# Altium schematic sheet M.2 m-key.SchDoc
size A4; SheetNumber: 1; SheetTotal: 1
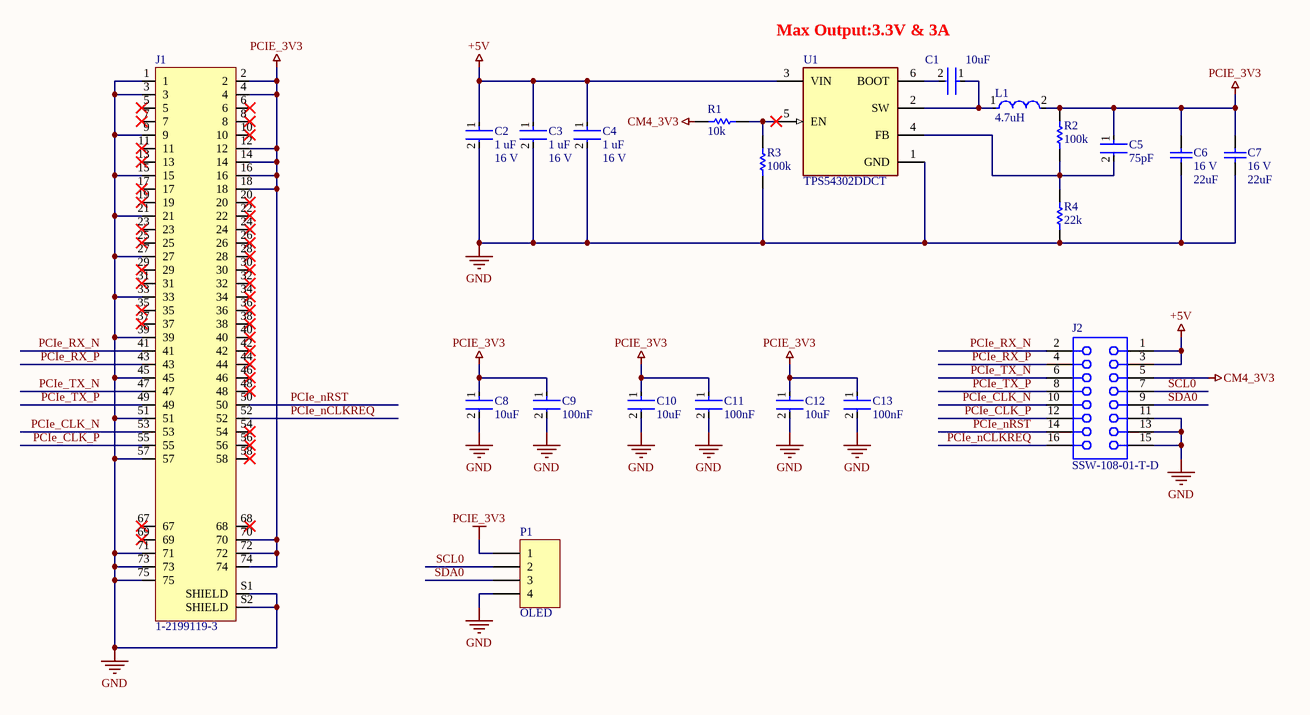
[diagram p0: M.2 m-key.SchDoc]

## Parts
C1  10uF  [FP-CC0603-DA-MFG]
C2  Capacitance: 1 uF  Voltage: 16 V  [FP-CC0603-DA-MFG]  (hidden comment: 1uF)
C3  Capacitance: 1 uF  Voltage: 16 V  [FP-CC0603-DA-MFG]  (hidden comment: 1uF)
C4  value 1 uF  Voltage: 16 V  [FP-CC0603-DA-MFG]  (hidden comment: 100nF)
C5  75pF  [FP-CC0603-DA-MFG]
C6  value 22uF  Rated Voltage: 16 V  [CAPC1206(3216)190_N]  (hidden comment: CAP 22uF 16V 1206(3216))
C7  value 22uF  Rated Voltage: 16 V  [CAPC1206(3216)190_N]  (hidden comment: CAP 22uF 16V 1206(3216))
C8  10uF  [FP-CC0603-DA-MFG]
C9  100nF  [FP-CC0603-DA-MFG]
C10  10uF  [FP-CC0603-DA-MFG]
C11  100nF  [FP-CC0603-DA-MFG]
C12  10uF  [FP-CC0603-DA-MFG]
C13  100nF  [FP-CC0603-DA-MFG]
J1  1-2199119-3  [1-2199119-3]
J2  SSW-108-01-T-D  [SMTC-SSW-108-01-X-D]
L1  Inductance: 4.7uH  [FP-XAL4030-472MEC-MFG]  (hidden comment: XAL4030-472MEC)
P1  OLED  [HDR1X4]
R1  Resistance: 10k  [RESC1608X55X25ML10T15]  (hidden comment: RC0603JR-0710KL)
R2  Resistance: 100k  [RESC1608X55X25ML10T15]  (hidden comment: RC0603FR-13100KL)
R3  Resistance: 100k  [RESC1608X55X25LL10T15]  (hidden comment: RC0603JR-10100KL)
R4  Resistance: 22k  [RESC1608X55X25ML10T15]  (hidden comment: RC0603FR-1022KL)
U1  TPS54302DDCT  [FP-DDC0006A-MFG]

## Nets
+5V: C2.1 C3.1 C4.1 J2.1 J2.3 U1.3(VIN)
CM4_3V3: J2.5 R1.2
GND: C2.2 C3.2 C4.2 C6.2 C7.2 C8.2 C9.2 C10.2 C11.2 C12.2 C13.2 J1.1 J1.3 J1.9 J1.15 J1.21 J1.27 J1.33 J1.39 J1.45 J1.51 J1.57 J1.71 J1.73 J1.75 J1.S1(SHIELD) J1.S2(SHIELD) J2.11 J2.13 J2.15 P1.4 R3.1 R4.2 U1.1(GND)
PCIE_3V3: C5.1 C6.1 C7.1 C8.1 C9.1 C10.1 C11.1 C12.1 C13.1 J1.2 J1.4 J1.12 J1.14 J1.16 J1.18 J1.70 J1.72 J1.74 L1.2 P1.1 R2.1
PCIe_CLK_N: J1.53 J2.10
PCIe_CLK_P: J1.55 J2.12
PCIe_nCLKREQ: J1.52 J2.16
PCIe_nRST: J1.50 J2.14
PCIe_RX_N: J1.41 J2.2
PCIe_RX_P: J1.43 J2.4
PCIe_TX_N: J1.47 J2.6
PCIe_TX_P: J1.49 J2.8
SCL0: J2.7 P1.2
SDA0: J2.9 P1.3
NetC1_1: C1.1 L1.1 U1.2(SW)
NetC1_2: C1.2 U1.6(BOOT)
NetC5_2: C5.2 R2.2 R4.1 U1.4(FB)
NetR1_1: R1.1 R3.2 U1.5(EN)

Not connected (* = marked no-connect by the designer): J1 5* 6* 7* 8* 10* 11* 13* 17* 19* 20* 22* 23* 24* 25* 26* 28* 29* 30* 31* 32* 34* 35* 36* 37* 38* 40* 42* 44* 46* 48* 54* 56* 58* 67* 68* 69*

## Notes on the sheet
- Max Output:3.3V & 3A
- Title:
- Author:
- Approved:
- Size:
- Date:
- Git Hash:
- A4
- Prj:
- SW Version:
- Variant:
- Edited:
- CONFIDENTIAL
- File:

## Library data of the parts
C1-C5 C8-C13 = CMP-03422-000924-1: CAP CER 1UF 16V X7R 0603; Manufacturer: YAGEO; Manufacturer Part Number: CC0603KRX7R7BB105; Tolerance: 0.1; Temperature Coefficient: 15%; Material: Ceramic; Package: CC0603-DA; RoHS: TRUE; Device Class L2: Capacitors; Temperature Characteristic: X7R; Temperature: -55°C to +125°C; Temperature Range Low: -55°C; Automotive: No; ComponentLink2Description: Datasheet; Lead Free: Yes; ComponentLink2URL: http://www.yageo.com/documents/recent/UPY-GPHC_X7R_6.3V-to-50V_18.pdf; Device Class L1: Passive Components; Octopart: https://octopart.com/cc0603krx7r7bb105-yageo-42271928; Category: Cap; Digikey Description: CAP CER 1UF 16V X7R 0603; Footprint Url: http://www.yageo.com/exep/pages/download/literatures/UPY-C_GEN_24.pdf; Height: 0.9mm; Voltage Rating: 16 V; Temperature Range High: +125°C; Mouser Description: Multilayer Ceramic Capacitor, CC Series, 1 - F, - 10%, X7R, 16 V, 0603 [1608 Metric]; Device Class L3: Ceramic Capacitors
  C1 C5 C8-C13: Value: 1 uF; Capacitance: 1 uF; Voltage: 16 V
  C2 C3: Value: 1 uF
  C4: Capacitance: 1 uF
C6 C7 = CMP-1037-04992-1: CAP 22uF 16V ±10% 1206 (3216 Metric) Thickness 1.9mm SMD; Case-EIA: 1206; Case-Metric: 3216; Tolerance: Â±10%; Technology: SMT; Max Thickness: 1.9 mm
J1 = 1-2199119-3: m.2 0.5pitch 3.2h Key m Goldflash; MF: {'manufacturer': u'TE Connectivity'}; Value: *; Price: None; MP: 1-2199119-3; Availability: Unavailable; Package: None
J2 = CMP-1023-00375-1: SQ Post Socket, Through-hole, Vertical, -55 to 105 degC, 2.54mm Pitch, 16-Pin, Female, RoHS; Manufacturer: Samtec; ComponentLink3Description: Package Specification; Orientation: Vertical; RoHS: True; PackageReference: SSW-108-01-X-D; PartNumber: SSW-108-01-T-D; PackageDescription: Assembly, Socket Strip .016 X .031 Tail; ComponentLink2Description: Datasheet; ComponentLink1URL: http://www.samtec.com; PackageVersion: CA, 6/1987; ComponentLink1Description: Manufacturer URL; Mounting Technology: Through-hole; DatasheetVersion: F-214; ComponentLink3URL: http://www.samtec.com/documents/webfiles/cpdf/SSW-1XX-XX-XXX-X-XX-XXX-XX-MKT.pdf; ComponentLink2URL: http://www.samtec.com/documents/webfiles/pdf/SSW_TH.PDF; Pitch: 2.54 mm; Temperature Range: -55 to 105 degC
L1 = CMP-11268-000082-1: Power Inductor (SMD), 4.7 µH, 5.1 A, Shielded, 4.5 A, XAL40xx Series, 4mm x 4mm x 3.1mm; Tolerance: 20%; DC Resistance (DCR): 44.1mR; Saturation Current: 4.5A; Max DC Current: 5.1A; Self Resonant Frequency: 36MHz; Test Frequency: 100kHz; Core Material: Composite; REACH SVHC: No SVHC; Height: 3.1mm; Package Quantity: 500; Width: 4.3mm; Mount: Surface Mount; RoHS Compliant: Yes; Case/Package: SMD/SMT; Length: 4.3mm; Packaging: Tape and Reel; Max Operating Temperature: 125°C; Min Operating Temperature: -40°C; Series: XAL4030; Termination: SMD/SMT; Inductance Tolerance: 20%; Shielding: Shielded; RMS Current (Irms): 5.1A; Lead Free: Contains Lead
P1 = Header 4: Header, 4-Pin; LatestRevisionDate: 17-Jul-2002; LatestRevisionNote: Re-released for DXP Platform.; Publisher: Altium Limited
R1 = CMP-2000-05022-1: Resistor, 10 KOhm, +/- 5%, 100 mW, -55 to 155 degC, 0603 (1608 Metric), RoHS, Tape and Reel; Manufacturer: Yageo; Voltage Rating: 50V; Temperature Coefficient: 100PPM/C; Power Rating: 100mW; Package Reference: 603; Series: RC; Case Code - mm: 1608; Packaging: Reel; Datasheet URL: http://www.farnell.com/datasheets/443971.pdf; Datasheet Version: Rev. 4, 04/2009; Operating Temperature Range: -55Cto+155C; Product: ThickFilmResistorsGeneralPurpose; Package Description: 2-Pin Surface Mount Device, Body 1.6 x 0.8 mm; Manufacturer URL: http://www.yageo.com/; Case Code - in: 0603; Tolerance: 5%; Termination Style: SMD/SMT
R2 = CMP-2000-04193-1: Manufacturer: Yageo; Part Number: RC0603FR-13100KL
R3 = CMP-2000-04301-1: Manufacturer: Yageo; Part Number: RC0603JR-10100KL
R4 = CMP-2000-04179-1: Manufacturer: Yageo; Part Number: RC0603FR-1022KL
U1 = CMP-04918-000098-1: IC REG BUCK ADJ 3A TSOT23-6; Manufacturer: Texas Instruments; Max Duty Cycle: 100%; Standoff Height: 0mm; Max Junction Temp: +125°C; Min Supply Voltage: 4.5V; Nominal Supply Current: 45uA; Output Voltage: 0.6-26V; Max Supply Voltage: 28V; Output Type: AdjustableProgrammable; Number Of Outputs: 1; Switching Frequency: 400kHz; Temperature Range High: +125°C; Switching Topology: Buck; Device Class L3: Voltage Regulators - Switching; Device Class L2: Power Management ICs; Lead Free: Yes; Height: 1.1mm; Package: DDC0006A; ComponentLink2Description: Datasheet; Device Class L1: Integrated Circuits (ICs); Manufacturer Part Number: TPS54302DDCT; Output Current: 3A; ComponentLink2URL: http://www.ti.com/lit/ds/symlink/tps54302.pdf; Automotive: No; Digikey Description: IC REG BUCK ADJ 3A TSOT23-6; Octopart: https://octopart.com/tps54302ddct-texas+instruments-74209026; RoHS: TRUE; Category: IC; Temperature Range Low: -40°C; Temperature: -40°C to +125°C